# EAGLE design Arduino_NRF24_RevD (EAGLE 6.6.0)
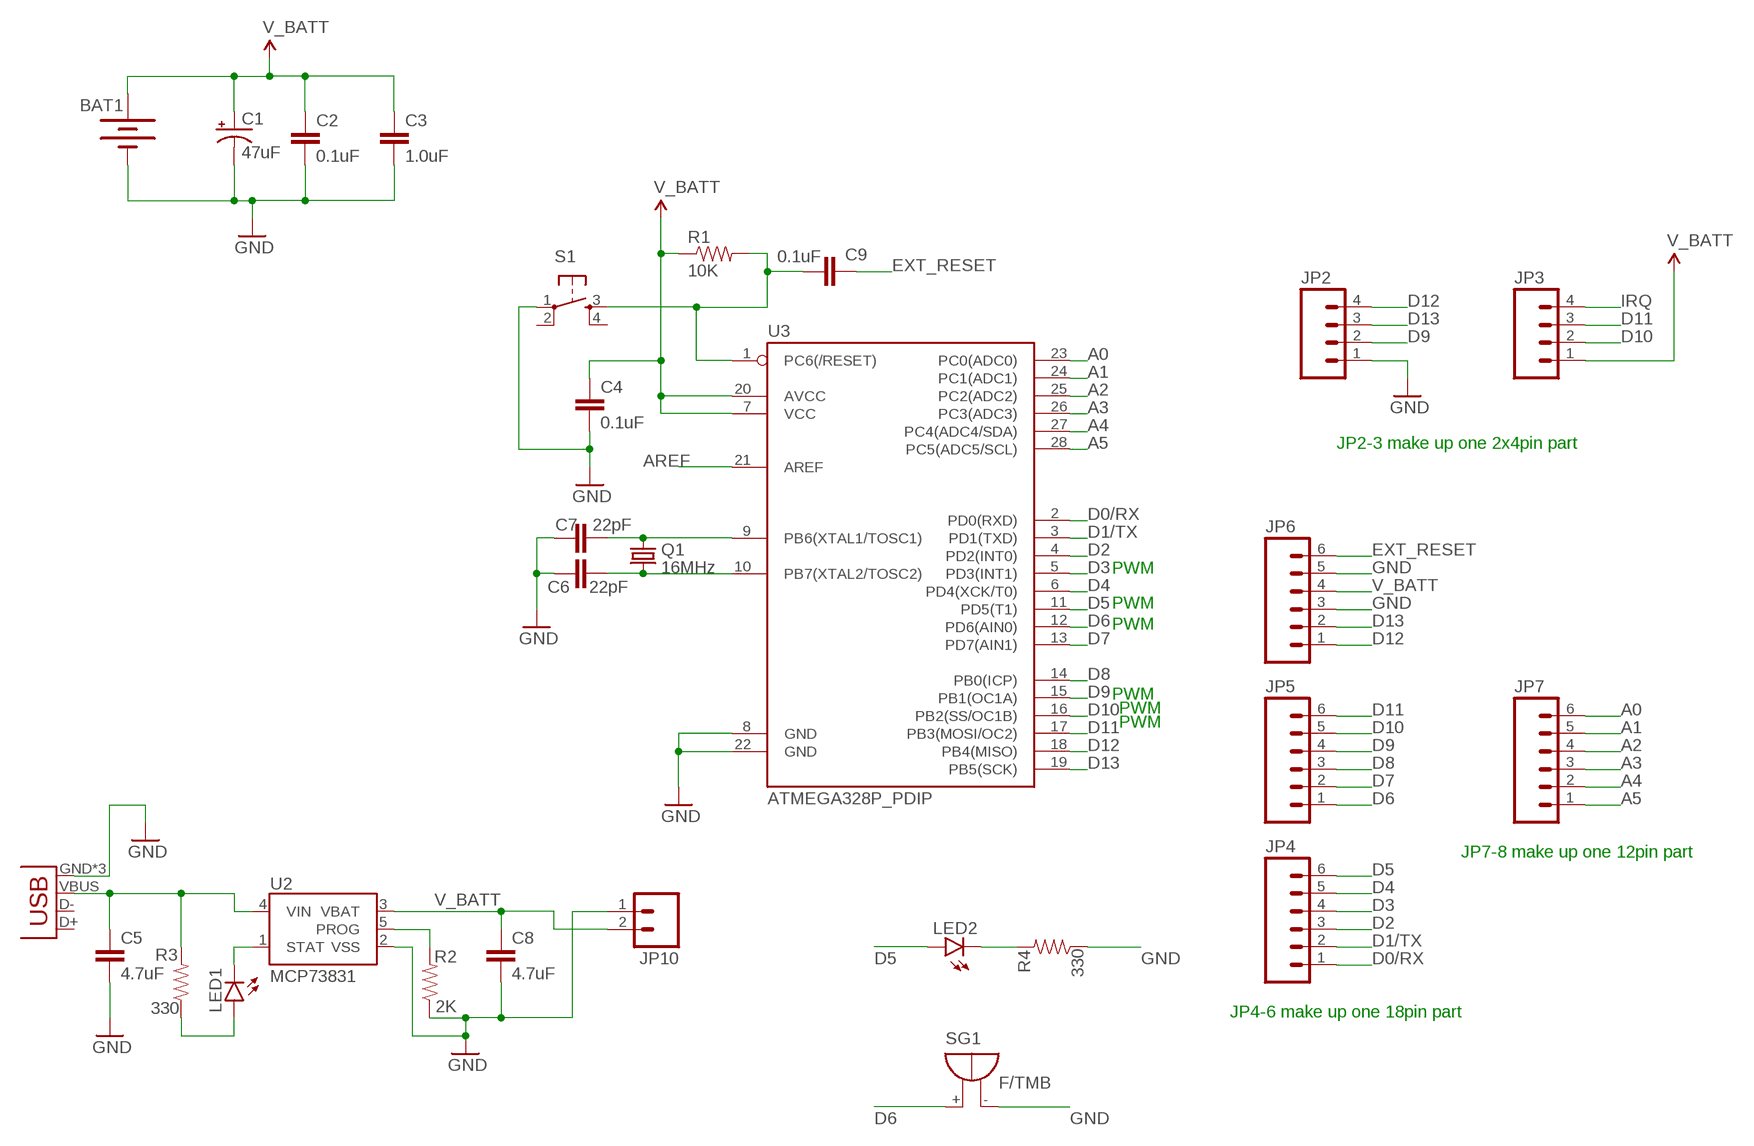
[diagram p0: schematic, sheet 1]

## Parts
BAT1  20mm coincell  BATTERY20MM_4LEGS  [BATTCON_20MM_4LEGS]
C1  47uF  CAP_POLPTH1  [CPOL-RADIAL-100UF-25V]
C2  0.1uF  CAPEZ  [CAP-PTH-SMALLEZ]
C3  1.0uF  CAPEZ  [CAP-PTH-SMALLEZ]
C4  0.1uF  CAPEZ  [CAP-PTH-SMALLEZ]
C5  4.7uF  CAPEZ  [CAP-PTH-SMALLEZ]
C6  22pF  CAPEZ  [CAP-PTH-SMALLEZ]
C7  22pF  CAPEZ  [CAP-PTH-SMALLEZ]
C8  4.7uF  CAPEZ  [CAP-PTH-SMALLEZ]
C9  0.1uF  CAPEZ  [CAP-PTH-SMALLEZ]
JP2  M04PTH  [1X04]
JP3  M04PTH  [1X04]
JP4  M06SIP  [1X06]
JP5  M06SIP  [1X06]
JP6  M06SIP  [1X06]
JP7  M06SIP  [1X06]
JP9  USB-MICROB  [USB-MICROB]
JP10  M02JST-PTH-2  [JST-2-PTH]
LED1  LED5MM  [LED5MM]
LED2  LED5MM  [LED5MM]
Q1  16MHz  CRYSTALHC49U-V  [HC49U-V]
R1  10K  RESISTORPTH-1/4W  [AXIAL-0.4]
R2  2K  RESISTORPTH-1/4W  [AXIAL-0.4]
R3  330  RESISTORPTH-1/4W  [AXIAL-0.4]
R4  330  RESISTORPTH-1/4W  [AXIAL-0.4]
S1  TAC_SWITCHSMD  [TACTILE_SWITCH_SMD]
SG1  F/TMB  [F/TMB]
U2  MCP73831  [SOT23-5]
U3  ATMEGA328P_PDIP  [DIL28-3]

## Nets
A0: JP7.6 U3.23(PC0(ADC0))
A1: JP7.5 U3.24(PC1(ADC1))
A2: JP7.4 U3.25(PC2(ADC2))
A3: JP7.3 U3.26(PC3(ADC3))
A4: JP7.2 U3.27(PC4(ADC4/SDA))
A5: JP7.1 U3.28(PC5(ADC5/SCL))
AREF: U3.21(AREF)
D0/RX: JP4.1 U3.2(PD0(RXD))
D1/TX: JP4.2 U3.3(PD1(TXD))
D2: JP4.3 U3.4(PD2(INT0))
D3: JP4.4 U3.5(PD3(INT1))
D4: JP4.5 U3.6(PD4(XCK/T0))
D5: JP4.6 LED2.A U3.11(PD5(T1))
D6: JP5.1 SG1.+ U3.12(PD6(AIN0))
D7: JP5.2 U3.13(PD7(AIN1))
D8: JP5.3 U3.14(PB0(ICP))
D9: JP2.2 JP5.4 U3.15(PB1(OC1A))
D10: JP3.2 JP5.5 U3.16(PB2(SS/OC1B))
D11: JP3.3 JP5.6 U3.17(PB3(MOSI/OC2))
D12: JP2.4 JP6.1 U3.18(PB4(MISO))
D13: JP2.3 JP6.2 U3.19(PB5(SCK))
EXT_RESET: C9.1 JP6.6
GND: BAT1.2(-) C1.2(-) C2.2 C3.2 C4.2 C5.2 C6.1 C7.2 C8.2 JP2.1 JP6.3 JP6.5 JP9.GND JP9.MT1(GND) JP9.MT2(GND) JP10.1 R2.P$1 R4.P$1 S1.1 SG1.- U2.2(VSS) U3.8(GND) U3.22(GND)
IRQ: JP3.4
N$1: C7.1 Q1.1 U3.9(PB6(XTAL1/TOSC1))
N$2: C6.2 Q1.2 U3.10(PB7(XTAL2/TOSC2))
N$4: LED1.K(C) U2.1(STAT)
N$7: LED1.A R3.P$1
N$8: C5.1 JP9.VBUS R3.P$2 U2.4(VIN)
N$10: LED2.K(C) R4.P$2
N$13: R2.P$2 U2.5(PROG)
RESET: C9.2 R1.P$2 S1.3 U3.1(PC6(/RESET))
V_BATT: BAT1.1(+) C1.1(+) C2.1 C3.1 C4.1 C8.1 JP3.1 JP6.4 JP10.2 R1.P$1 U2.3(VBAT) U3.7(VCC) U3.20(AVCC)
Unconnected: JP9.D+ JP9.D- S1.2 S1.4

## Notes on the sheet
- JP2-3 make up one 2x4pin part
- PWM
- PWM
- PWM
- PWM
- PWM
- PWM
- JP7-8 make up one 12pin part
- JP4-6 make up one 18pin part

## Library data of the parts
BAT1 = SparkFun-Electromechanical:BATTERY: Battery Holders Various common sizes : AA, AAA, 20mm coin cell and 12mm coin cell. 20MM_4LEGS, BATT-10373; MF: KEYSTONE ELECTR; MPN: 1065; OC_NEWARK: 59K0293; PROD_ID: BATT-10373
C1 = SparkFun-Capacitors:CAP_POL: Capacitor Polarized These are standard SMD and PTH capacitors. Normally 10uF, 47uF, and 100uF in electrolytic and tantalum varieties. Always verify the external diameter of the through hole cap, it varies with capacity, voltage, and manufacturer. The EIA devices should be standard.; MPN: MCTG470M1AB-0512P; OC_NEWARK: 79R7665
C2 C4 C9 = SparkFun-Capacitors:CAP: Capacitor Standard 0603 ceramic capacitor, and 0.1" leaded capacitor.; MF: BC COMPONENTS; MPN: K104K15X7RF5TL2; OC_NEWARK: 85C4656
C3 = SparkFun-Capacitors:CAP: Capacitor Standard 0603 ceramic capacitor, and 0.1" leaded capacitor.; MPN: MCNP16V105M5X11; OC_NEWARK: 13M5148
C5 C8 = SparkFun-Capacitors:CAP: Capacitor Standard 0603 ceramic capacitor, and 0.1" leaded capacitor.; MF: Multicomp Passives; MPN: MCLV4R7M1HB-0513-RH; OC_NEWARK: 79K3674
C6 C7 = SparkFun-Capacitors:CAP: Capacitor Standard 0603 ceramic capacitor, and 0.1" leaded capacitor.; MPN: MCCC50V220JNPO; OC_NEWARK: 97M5068
JP2 JP3 = SparkFun-Connectors:M04: Header 4 Standard 4-pin 0.1" header. Use with straight break away headers (SKU : PRT-00116), right angle break away headers (PRT-00553), swiss pins (PRT-00743), machine pins (PRT-00117), and female headers (PRT-00115). Molex polarized connector foot print use with SKU : PRT-08231 with associated crimp pins and housings. 1MM SMD Version SKU: PRT-10208; MPN: BIM-INT-Y1X-0.4M-RS 4.21T W/M; OC_NEWARK: 36R0204
JP4-JP7 = SparkFun-Connectors:M06: Header 6 Standard 6-pin 0.1" header. Use with straight break away headers (SKU : PRT-00116), right angle break away headers (PRT-00553), swiss pins (PRT-00743), machine pins (PRT-00117), and female headers (PRT-00115). Molex polarized connector foot print use with SKU : PRT-08094 with associated crimp pins and housings. NOTES ON THE VARIANTS LOCK and LOCK_LONGPADS... This footprint was designed to help hold the alignment of a through-hole component (i.e. 6-pin header) while soldering it into place. You may notice that each hole has been shifted either up or down by 0.005 of an inch from it's more standard position (which is a perfectly straight line). This slight alteration caused the pins (the squares in the middle) to touch the edges of the holes. Because they are alternating, it causes a "brace" to hold the component in place. 0.005 has proven to be the perfect amount of "off-center" position when using our standard breakaway headers. Although looks a little odd when you look at the bare footprint, once you have a header in there, the alteration is very hard to notice. Also,if you push a header all the way into place, it is covered up entirely on the bottom side. This idea of altering the position of holes to aid alignment will be further integrated into the Sparkfun Library for other footprints. It can help hold any component with 3 or more connection pins.; MPN: BI1.5-H6.5-Y1X-0.6M-RS4.21T; OC_NEWARK: 31Y7469
JP9 = SparkFun-Connectors:USB: USB Connectors USB-B-PTH is fully proven SKU : PRT-00139/CONN-08278 USB-miniB is fully proven SKU : PRT-00587 USB-A-PCB is untested. USB-A-H is throughly reviewed, but untested. Spark Fun Electronics SKU : PRT-00437 USB-B-SMT is throughly reviewed, but untested. Needs silkscreen touching up. USB-A-S has not been used/tested USB-MB-H has not been used/tested USB-MICROB has been used. CONN-09505; MPN: USB3100-30-A; OC_NEWARK: 07W3659; PROD_ID: CONN-09505
JP10 = SparkFun-Connectors:M02: Standard 2-pin 0.1" header. Use with - straight break away headers ( PRT-00116) - right angle break away headers (PRT-00553) - swiss pins (PRT-00743) - machine pins (PRT-00117) - female headers (PRT-00115) Molex polarized connector foot print use with: PRT-08233 with associated crimp pins and housings. 2.54_SCREWTERM for use with PRT-10571. 3.5mm Screw Terminal footprints for PRT-08084 5mm Screw Terminal footprints for use with PRT-08433; MF: MOLEX; MPN: 26-60-4020; OC_NEWARK: 56H5828; SKU: PRT-09914
LED1 LED2 = SparkFun-LED:LED: LEDs Standard schematic elements and footprints for 5mm, 3mm, 1206, and 0603 sized LEDs. 5mm - Spark Fun Electronics SKU : COM-00529 (and others); MPN: C503B-BCN-CV0Z0461; OC_NEWARK: 04R6674
Q1 = crystal:CRYSTAL: CRYSTAL; MPN: ABLSG-16.000MHZ-D-2-Y-T; OC_FARNELL: 1666969; OC_NEWARK: 01T1300
R1 = SparkFun-Passives:RESISTOR: Resistor Basic schematic elements and footprints for 0603, 1206, and PTH resistors.; MF: FARNELL; MPN: MC0063W0603510K; OC_NEWARK: 39K0074
R2 = SparkFun-Passives:RESISTOR: Resistor Basic schematic elements and footprints for 0603, 1206, and PTH resistors.; MF: MCM ELECTRONICS; MPN: 34-2K; OC_NEWARK: 38C9523
R3 R4 = SparkFun-Passives:RESISTOR: Resistor Basic schematic elements and footprints for 0603, 1206, and PTH resistors.; MF: FARNELL; MPN: MCF 0.5W 330R; OC_NEWARK: 38K0292
S1 = SparkFun-Electromechanical:TAC_SWITCH: Momentary Switch Button commonly used for reset or general input. Spark Fun Electronics SKU : COM-00097 SMT- SWCH-08247; MPN: 1571218-6; OC_NEWARK: 41T2133; PROD_ID: SWCH-08247
SG1 = buzzer:F/TMB: BUZZER Source: Buerklin; MPN: MCKPI-G2913L-3973; OC_FARNELL: unknown; OC_NEWARK: 25R0655
U2 = SparkFun-PowerIC:MCP73831: Miniature single cell, fully integrated Li-Ion, Li-polymer charge management controller http://ww1.microchip.com/downloads/en/DeviceDoc/21984a.pdf IC-09995; MPN: MCP73831T-2ACI/OT; OC_NEWARK: 56K7045; PROD_ID: IC-09995
U3 = SparkFun-DigitalIC:ATMEGA328P_PDIP: uC used in the Arduino 32kb flash, 1k EEPROM, 2k SRAM This is the through-hole version of this chip.; MPN: ATMEGA328P-PU; OC_NEWARK: 68T2944

## Net classes
0 default: width 0.305 mm, drill 0.508 mm, clearance 0.254 mm

## Board
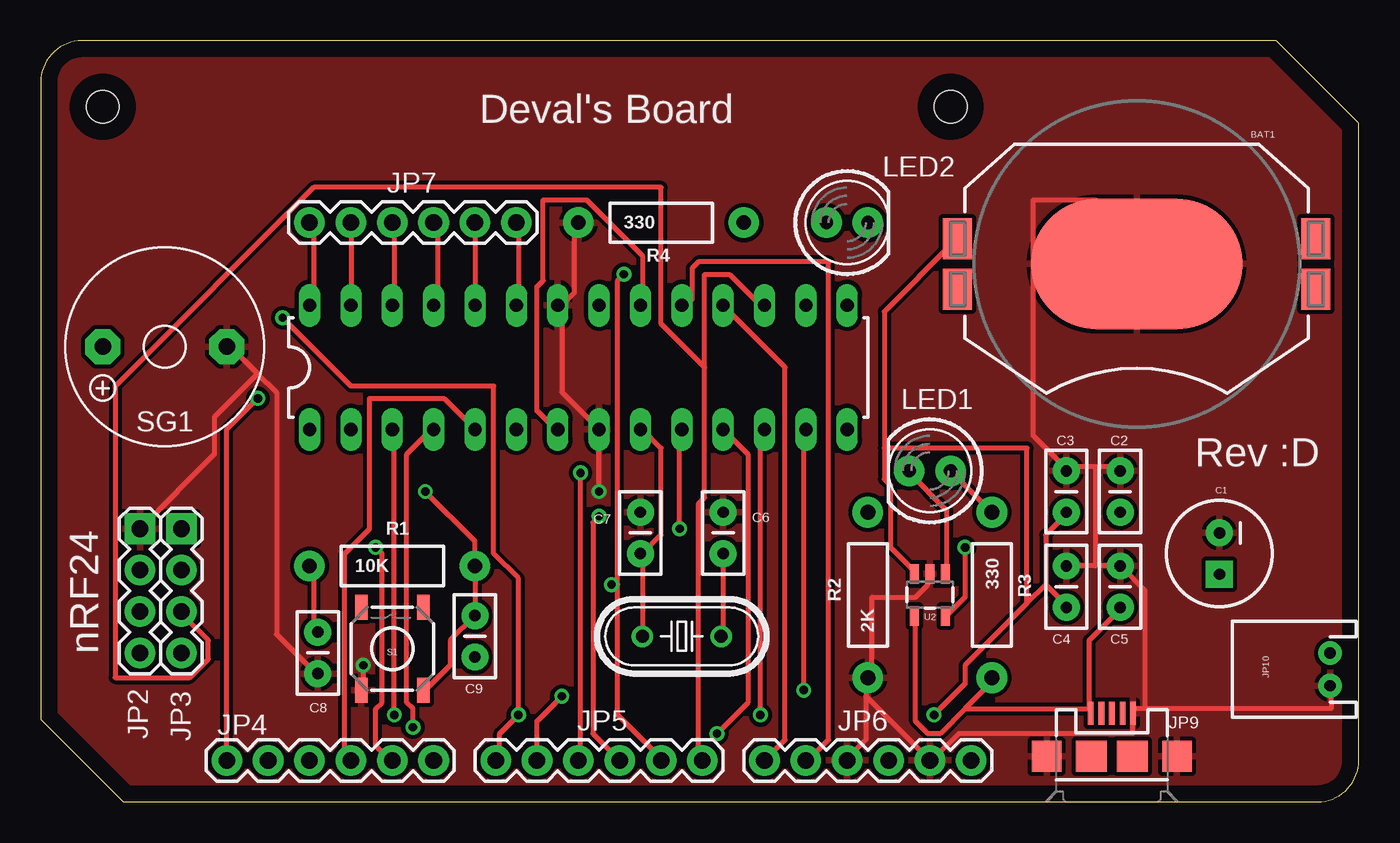
[diagram p1: board, top side]
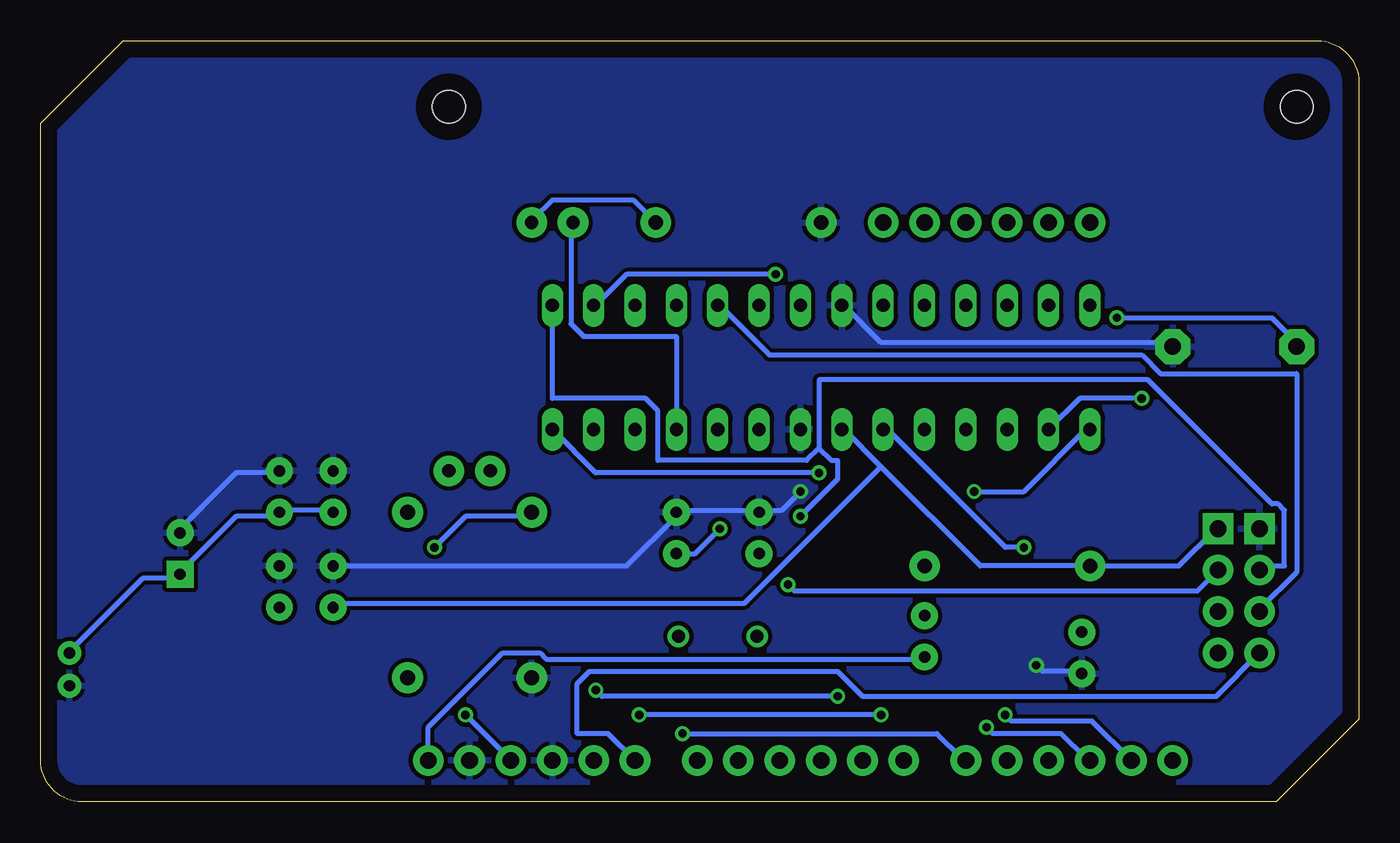
[diagram p2: board, bottom side, seen from below]

Size 80.95 x 46.73 mm. Coordinates in mm from the lower left corner, seen from the top.
Outline: 5.08,0 78.41,0 arc90 80.95,2.54 80.95,41.65 75.87,46.73 2.54,46.73 arc90 0,44.19 0,5.08 5.08,0
Copper layers (1*16): Top 0.035mm / dielectric 1.5mm / Bottom 0.035mm
Design rules "default *": minimum track width 9mil, minimum drill 20mil, track to track 8mil, track to pad 8mil, pad to pad 8mil, via to via 8mil, smd to smd 8mil, copper to edge 40mil, drill to drill 8mil, minimum pad ring 10mil, minimum via ring 8mil, stop-mask expansion 4mil, vias tented up to drill 0mil, thermal gap 10mil
Holes 2 mm at 3.81,42.67 55.88,42.67

### Footprints (pad centres in the part's own frame; a part is rotated, then mirrored left to right if it is on the bottom)
BATTCON_20MM_4LEGS = smd 1.778 x 2.54: 1 -11,1.55; 3 11,1.55; P$1 -11,-1.55; P$2 11,-1.55 | smd 13 x 8: 2 0,0
CPOL-RADIAL-100UF-25V = drill 0.7 pad 1.651 square: 1 1.27,0 | drill 0.7 pad 1.651: 2 -1.27,0
CAP-PTH-SMALLEZ = drill 0.7 pad 1.651: 1 0,0; 2 2.54,0
1X04 = drill 1.016 pad 1.88 square: 1 0,0 | drill 1.016 pad 1.88: 2 2.54,0; 3 5.08,0; 4 7.62,0
1X06 = drill 1.016 pad 1.88: 1 0,0; 2 2.54,0; 3 5.08,0; 4 7.62,0; 5 10.16,0; 6 12.7,0
USB-MICROB = smd 0.35 x 1.4: D+ 0,2.65; D- -0.65,2.65; GND 1.3,2.65; ID 0.65,2.65; VBUS -1.3,2.65 | smd 1.8 x 1.9: MT1 -4,0; MT2 4,0 | smd 1.9 x 1.9: P$1 -1.27,0; P$2 1.27,0
JST-2-PTH = drill 0.7 pad 1.448: 1 -1,0; 2 1,0
LED5MM = drill 0.813 pad 1.88: A -1.27,0; K 1.27,0
HC49U-V = drill 0.813: 1 -2.413,0; 2 2.413,0
AXIAL-0.4 = drill 0.9 pad 1.88: P$1 -5.08,0; P$2 5.08,0
TACTILE_SWITCH_SMD = smd 1.524 x 0.762: 1 -2.54,1.905; 2 2.54,1.905; 3 -2.54,-1.905; 4 2.54,-1.905
F/TMB = drill 1.016 pad 2.159 octagon: + 3.81,0; - -3.81,0
SOT23-5 = smd 0.55 x 1.2: 1 -0.95,-1.3; 2 0,-1.3; 3 0.95,-1.3; 4 0.95,1.3; 5 -0.95,1.3
DIL28-3 = drill 0.813 long: 1 -16.51,-3.81; 2 -13.97,-3.81; 3 -11.43,-3.81; 4 -8.89,-3.81; 5 -6.35,-3.81; 6 -3.81,-3.81; 7 -1.27,-3.81; 8 1.27,-3.81; 9 3.81,-3.81; 10 6.35,-3.81; 11 8.89,-3.81; 12 11.43,-3.81; 13 13.97,-3.81; 14 16.51,-3.81; 15 16.51,3.81; 16 13.97,3.81; 17 11.43,3.81; 18 8.89,3.81; 19 6.35,3.81; 20 3.81,3.81; 21 1.27,3.81; 22 -1.27,3.81; 23 -3.81,3.81; 24 -6.35,3.81; 25 -8.89,3.81; 26 -11.43,3.81; 27 -13.97,3.81; 28 -16.51,3.81

### Placement (x,y rotation side)
BAT1  67.31,33.02 0 top
C1  72.39,15.24 270 top
C2  66.29,17.78 90 top
C3  62.99,17.78 90 top
C4  62.99,11.94 90 top
C5  66.29,11.94 90 top
C6  41.91,17.78 270 top
C7  36.83,15.24 90 top
C8  17.02,10.41 270 top
C9  26.67,8.89 90 top
JP2  6.1,16.76 270 top
JP3  8.64,16.76 270 top
JP4  11.43,2.54 0 top
JP5  27.94,2.54 0 top
JP6  44.45,2.54 0 top
JP7  16.51,35.56 0 top
JP9  65.79,2.79 0 top
JP10  79.18,8.13 90 top
LED1  54.61,20.32 180 top
LED2  49.53,35.56 0 top
Q1  39.37,10.16 0 top
R1  21.59,14.48 0 top
R2  50.8,12.7 90 top
R3  58.42,12.7 270 top
R4  38.1,35.56 0 top
S1  21.59,9.4 90 top
SG1  7.62,27.94 180 top
U2  54.61,12.7 180 top
U3  33.02,26.67 0 top

### Tracks (layer width: path | path; a pad name or v marks a point on that pad's centre or on a via)
A0
  Top 0.305: U3.23 29.34,30.48 29.34,35.43 JP7.6
A1
  Top 0.305: JP7.5 U3.24
A2
  Top 0.305: U3.25 24.38,30.48 24.38,35.43 JP7.4
A3
  Top 0.305: U3.26 21.72,30.48 21.72,35.43 JP7.3
A4
  Top 0.305: JP7.2 U3.27
A5
  Top 0.305: U3.28 16.76,30.48 16.76,35.43 JP7.1
D0/RX  (via drill 0.51)
  Top 0.305: v13.34,24.77 11.43,22.86 JP4.1
  Bottom 0.305: U3.2 17.14,24.77 v13.34,24.77
D1/TX  (via drill 0.51)
  Top 0.305: v21.72,5.33 21.72,22.86 U3.3
  Bottom 0.305: v21.72,5.33 21.34,4.95 16.38,4.95 JP4.2
D2  (via drill 0.51)
  Top 0.305: v22.86,4.57 22.86,5.71 22.48,6.1 22.48,21.34 24,22.86 U3.4
  Bottom 0.305: v22.86,4.57 22.48,4.19 18.29,4.19 16.76,2.67 JP4.3
D3
  Top 0.305: U3.5 24.77,24.77 20.19,24.77 20.19,16.76 18.67,15.24 18.67,3.05 19.05,2.67 JP4.4
D4  (via drill 0.51)
  Top 0.305: v20.57,15.62 20.95,15.24 20.95,6.1 20.57,5.71 20.57,3.43 21.34,2.67 JP4.5
  Bottom 0.305: v20.57,15.62 21.72,15.62 28.96,22.86 U3.6
D5  (via drill 0.51)
  Top 0.305: v41.53,4.19 43.43,6.1 43.43,21.34 U3.11
  Bottom 0.305: U3.11 41.91,28.57 47.62,28.57 48.39,29.34 48.39,35.43 LED2.A | v41.53,4.19 25.91,4.19 24.38,2.67 JP4.6
D6  (via drill 0.51)
  Top 0.305: v44.2,5.33 44.2,22.86 U3.12 | JP5.1 28.19,2.67 28.19,4.19 v29.34,5.33 29.34,13.72 27.81,15.24 27.81,25.53 19.05,25.53 v14.86,29.72
  Bottom 0.305: v29.34,5.33 v44.2,5.33 | v14.86,29.72 5.33,29.72 3.81,28.19 SG1.+
D7  (via drill 0.51)
  Top 0.305: v46.86,6.86 46.86,22.86 U3.13 | v32,6.48 30.48,4.95 JP5.2
  Bottom 0.305: v46.86,6.86 46.48,6.48 v32,6.48
D8  (via drill 0.51)
  Top 0.305: v33.15,20.19 33.15,2.67 JP5.3
  Bottom 0.305: U3.14 46.86,20.19 v33.15,20.19
D9  (via drill 0.51)
  Top 0.305: JP5.4 33.91,4.19 33.91,17.14 v34.29,17.53
  Bottom 0.305: U3.15 49.53,24.77 43.81,24.77 43.05,24 43.05,20.95 33.91,20.95 33.15,21.72 | 33.15,21.72 33.15,25.91 12.95,25.91 5.33,18.29 4.95,18.29 4.57,17.91 4.57,14.48 6.1,14.48 JP2.2 | v34.29,17.53 32,19.81 32,20.95 32.38,20.95 33.15,21.72
D10  (via drill 0.51)
  Top 0.305: v35.81,32.38 35.43,32 35.43,13.34 | 35.43,13.34 35.43,5.33 38.1,2.67 JP5.5 | 35.43,13.34 v35.05,13.34
  Bottom 0.305: v35.81,32.38 44.96,32.38 46.86,30.48 U3.16 | JP3.2 9.91,12.95 34.67,12.95 v35.05,13.34
D11
  Top 0.305: 40.77,26.67 40.77,18.67 40.39,18.29 40.39,2.67 JP5.6 | 40.77,26.67 40.77,32.38 42.29,32.38 44.2,30.48 U3.17 | 40.77,26.67 38.1,29.34 38.1,37.72 16.76,37.72 4.57,25.53 4.57,7.62 9.14,7.62 10.29,8.76 10.29,9.91 8.76,11.43 JP3.3
D12
  Top 0.305: U3.18 45.72,26.67 45.72,3.81 JP6.1
  Bottom 0.305: JP2.4 8.76,6.48 30.48,6.48 32,8 47.24,8 48.01,7.24 48.01,4.19 46.1,4.19 JP6.1
D13
  Top 0.305: U3.19 39.62,30.48 40.01,30.86 40.01,32.77 40.39,33.15 48.39,33.15 48.39,3.81 47.24,2.67 JP6.2
  Bottom 0.305: JP2.3 6.1,11.81 3.81,14.1 3.81,26.29 12.19,26.29 13.34,27.43 36.2,27.43 39.24,30.48 U3.19
EXT_RESET
  Bottom 0.305: JP6.6 57.15,4.57 52.58,9.14 50.29,9.14 49.91,8.76 26.67,8.76 C9.1
GND  (via drill 0.51)
  Top 0.305: 32,30.48 32.77,31.24 32.77,35.43 R4.P$1 | 32,30.48 32,25.15 U3.8 v34.29,19.05 | 32,30.48 U3.22 | v19.81,8.38 19.81,6.86 S1.1 | 13.34,26.29 11.43,28.19 SG1.- | 13.34,26.29 14.48,25.15 14.48,10.29 16.76,8 C8.2 | JP2.1 10.67,21.34 10.67,23.62 13.34,26.29 | U2.2 54.48,13.72 54.48,13.34 53.72,12.57 51.05,12.57 51.05,7.62 R2.P$1 50.67,7.62 50.67,6.48 | 50.67,6.48 50.67,3.81 49.53,2.67 JP6.3 | 50.67,6.48 JP6.5 54.86,2.67 56.39,4.19 67.06,4.19 67.06,5.33 JP9.GND 67.06,5.71 67.82,5.71 | 67.82,5.71 79.25,5.71 JP10.1 | 64.77,14.48 C5.2 67.82,12.95 67.82,5.71 | 64.77,14.48 C4.2 | 64.77,20.57 66.29,20.57 C2.2 | 64.77,20.57 63.25,20.57 C3.2 62.87,20.57 60.96,22.48 60.96,36.96 64.77,36.96 66.29,35.43 66.29,33.91 67.06,33.15 BAT1.2 | 64.77,20.57 64.77,14.48
  Bottom 0.305: v19.81,8.38 19.43,8 17.14,8 C8.2 | U3.22 31.62,30.48 29.34,28.19 11.43,28.19 SG1.- | C1.2 72.39,16.76 68.96,20.19 66.29,20.19 C2.2 | C4.2 44.96,14.48 41.91,17.53 C6.1 41.91,17.91 36.96,17.91 C7.2 36.58,17.91 35.43,17.91 v34.29,19.05
  pour Bottom: -4.06,50.04 -5.59,50.04 -5.59,-4.32 85.34,-4.32 85.34,49.78 -4.06,49.78
  pour Top: -3.81,48.51 -4.32,48.51 -4.32,-4.83 84.07,-4.83 84.07,49.02 -3.56,49.02 -3.56,48.51
N$1
  Top 0.305: 36.96,15.24 38.1,16.38 38.1,21.72 36.96,22.86 U3.9 | 36.96,15.24 Q1.1 | 36.96,15.24 C7.1
N$2  (via drill 0.51)
  Top 0.305: v39.24,16.76 39.24,22.86 U3.10 | C6.2 41.91,10.29 Q1.2
  Bottom 0.305: v39.24,16.76 40.77,15.24 C6.2
N$4
  Top 0.305: U2.1 55.63,14.1 55.63,17.91 53.34,20.19 LED1.K
N$7
  Top 0.305: LED1.A R3.P$1
N$8
  Top 0.305: 56.77,5.71 58.29,7.24 58.29,7.62 R3.P$2 | 56.77,5.71 55.24,4.19 54.48,4.19 53.72,4.95 53.72,11.05 U2.4 | 56.77,5.71 64.39,5.71 | 64.39,5.71 64.39,9.91 66.29,11.81 C5.1 | 64.39,5.71 JP9.VBUS
N$10
  Bottom 0.305: R4.P$2 44.58,36.96 49.53,36.96 50.67,35.81 LED2.K
N$13  (via drill 0.51)
  Top 0.305: v56.77,15.62 56.77,12.57 55.63,11.43 U2.5
  Bottom 0.305: v56.77,15.62 54.86,17.53 51.05,17.53 R2.P$2
RESET  (via drill 0.51)
  Top 0.305: S1.3 23.62,6.86 25.15,8.38 25.15,9.91 C9.2 R1.P$2 26.67,16 v23.62,19.05
  Bottom 0.305: v23.62,19.05 20.57,19.05 16.76,22.86 U3.1
V_BATT  (via drill 0.51)
  Top 0.305: U3.20 36.96,30.48 36.96,33.53 33.53,36.96 30.86,36.96 30.86,32 30.48,31.62 30.48,24 31.62,22.86 U3.7 | C8.1 16.76,10.67 16.76,14.48 R1.P$1 | 51.82,21.72 51.82,30.1 56.01,34.29 BAT1.1 | 51.82,21.72 51.82,19.81 52.2,19.43 52.2,15.62 53.72,14.1 U2.3 | 61.72,13.34 62.87,12.19 C4.1 | 61.72,13.34 61.72,16.38 62.87,17.53 C3.1 | v54.86,5.33 56.77,7.24 56.77,8.38 60.58,12.19 | 61.72,13.34 60.58,12.19 | 51.82,21.72 60.58,21.72 60.58,12.19
  Bottom 0.305: 29.34,20.57 23.24,14.48 R1.P$1 11.05,14.48 8.76,16.76 JP3.1 | 29.34,20.57 31.62,22.86 U3.7 | JP10.2 79.25,9.14 74.68,13.72 72.39,13.72 C1.1 72.39,14.1 68.96,17.53 66.29,17.53 C2.1 66.29,17.91 63.25,17.91 C3.1 | v54.86,5.33 JP6.4 | 29.34,20.57 37.72,12.19 62.87,12.19 C4.1

### Text on the board
tPlace: Deval's Board
tNames: Rev :D | nRF24